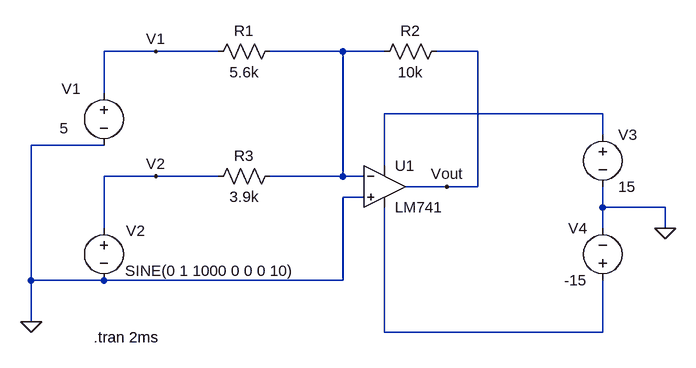
[diagram p0: schematic summing_ inverting_ amplifier.asc]
summing_ inverting_ amplifier.asc, the LTspice schematic file:
Version 4
SHEET 1 996 680
WIRE 192 16 112 16
WIRE 288 16 192 16
WIRE 480 16 368 16
WIRE 544 16 480 16
WIRE 688 16 624 16
WIRE 112 80 112 16
WIRE 880 112 544 112
WIRE 880 144 880 112
WIRE 112 160 0 160
WIRE 544 192 544 112
WIRE 192 208 112 208
WIRE 288 208 192 208
WIRE 480 208 480 16
WIRE 480 208 368 208
WIRE 512 208 480 208
WIRE 640 224 576 224
WIRE 688 224 688 16
WIRE 688 224 640 224
WIRE 512 240 480 240
WIRE 880 256 880 224
WIRE 976 256 880 256
WIRE 112 288 112 208
WIRE 880 288 880 256
WIRE 976 288 976 256
WIRE 0 368 0 160
WIRE 112 368 0 368
WIRE 480 368 480 240
WIRE 480 368 112 368
WIRE 0 432 0 368
WIRE 544 448 544 256
WIRE 880 448 880 368
WIRE 880 448 544 448
FLAG 0 432 0
FLAG 640 224 Vout
FLAG 976 288 0
FLAG 192 16 V1
FLAG 192 208 V2
SYMBOL voltage 112 64 R0
WINDOW 0 -65 9 Left 2
WINDOW 3 -68 70 Left 2
WINDOW 123 0 0 Left 0
WINDOW 39 0 0 Left 0
SYMATTR InstName V1
SYMATTR Value 5
SYMBOL voltage 112 272 R0
WINDOW 0 34 20 Left 2
WINDOW 3 33 81 Left 2
WINDOW 123 0 0 Left 0
WINDOW 39 0 0 Left 0
SYMATTR InstName V2
SYMATTR Value SINE(0 1 1000 0 0 0 10)
SYMBOL LM741 544 160 R0
SYMATTR InstName U1
SYMBOL res 384 0 R90
WINDOW 0 0 56 VBottom 2
WINDOW 3 32 56 VTop 2
SYMATTR InstName R1
SYMATTR Value 5.6k
SYMBOL res 640 0 R90
WINDOW 0 0 56 VBottom 2
WINDOW 3 32 56 VTop 2
SYMATTR InstName R2
SYMATTR Value 10k
SYMBOL res 384 192 R90
WINDOW 0 0 56 VBottom 2
WINDOW 3 32 56 VTop 2
SYMATTR InstName R3
SYMATTR Value 3.9k
SYMBOL voltage 880 128 R0
WINDOW 123 0 0 Left 0
WINDOW 39 0 0 Left 0
SYMATTR InstName V3
SYMATTR Value 15
SYMBOL voltage 880 384 R180
WINDOW 0 24 96 Left 2
WINDOW 3 24 16 Left 2
WINDOW 123 0 0 Left 0
WINDOW 39 0 0 Left 0
SYMATTR InstName V4
SYMATTR Value -15
TEXT 96 456 Left 2 !.tran 2ms

The netlist it stands for:
* summing_ inverting_ amplifier.asc
V1 V1 0 5
V2 V2 0 SINE(0 1 1000 0 0 0 10)
XU1 0 N001 N002 N003 Vout LM741  ; pins In+ In- V+ V- OUT
R1 N001 V1 5.6k
R2 Vout N001 10k
R3 N001 V2 3.9k
V3 N002 0 15
V4 N003 0 -15
.tran 2ms
.lib LM741.lib
.backanno
.end